# EasyEDA Pro project Photo_cam.epro

# Board PCB1
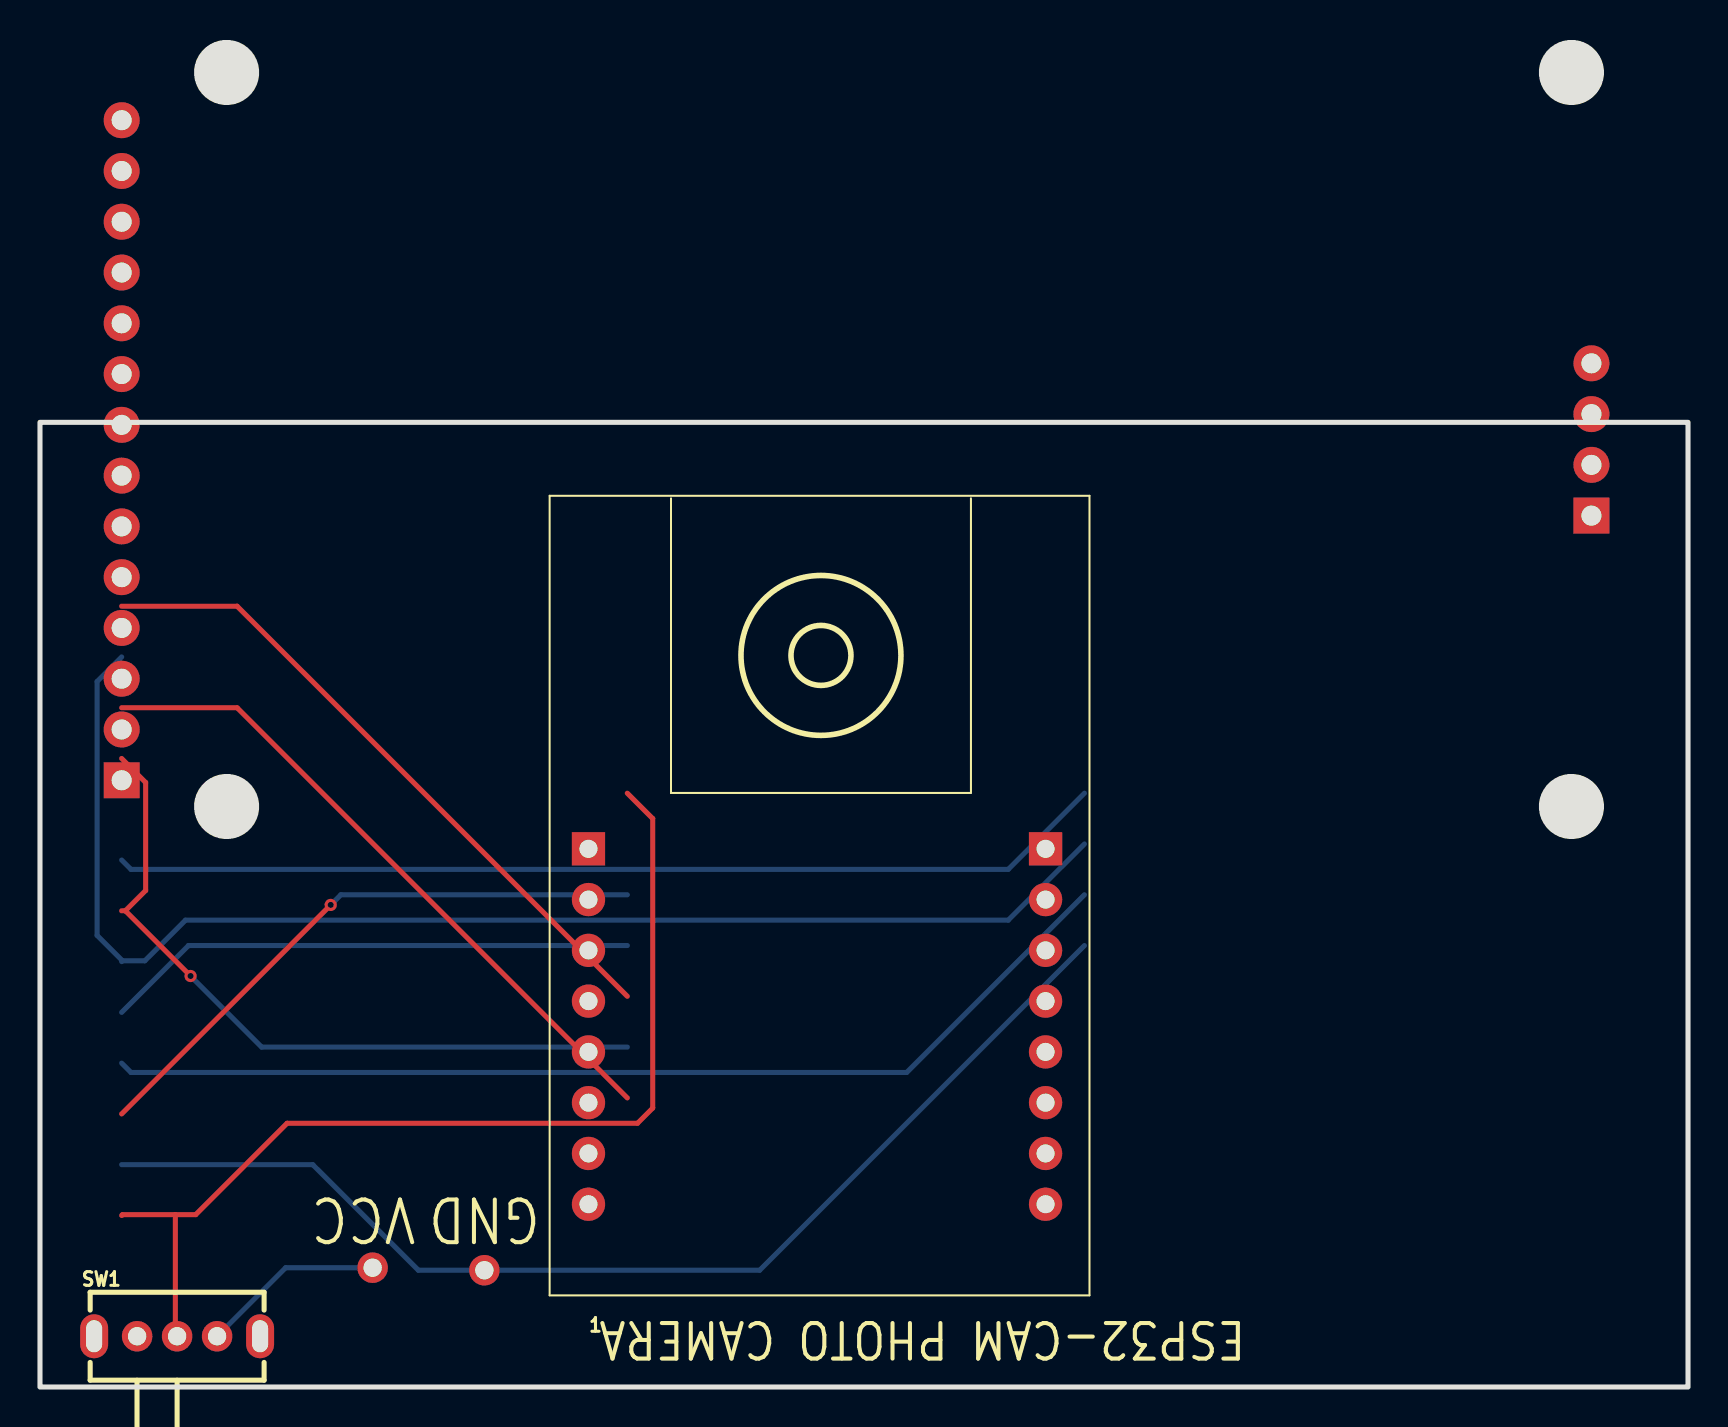
[diagram p0: board, top side]
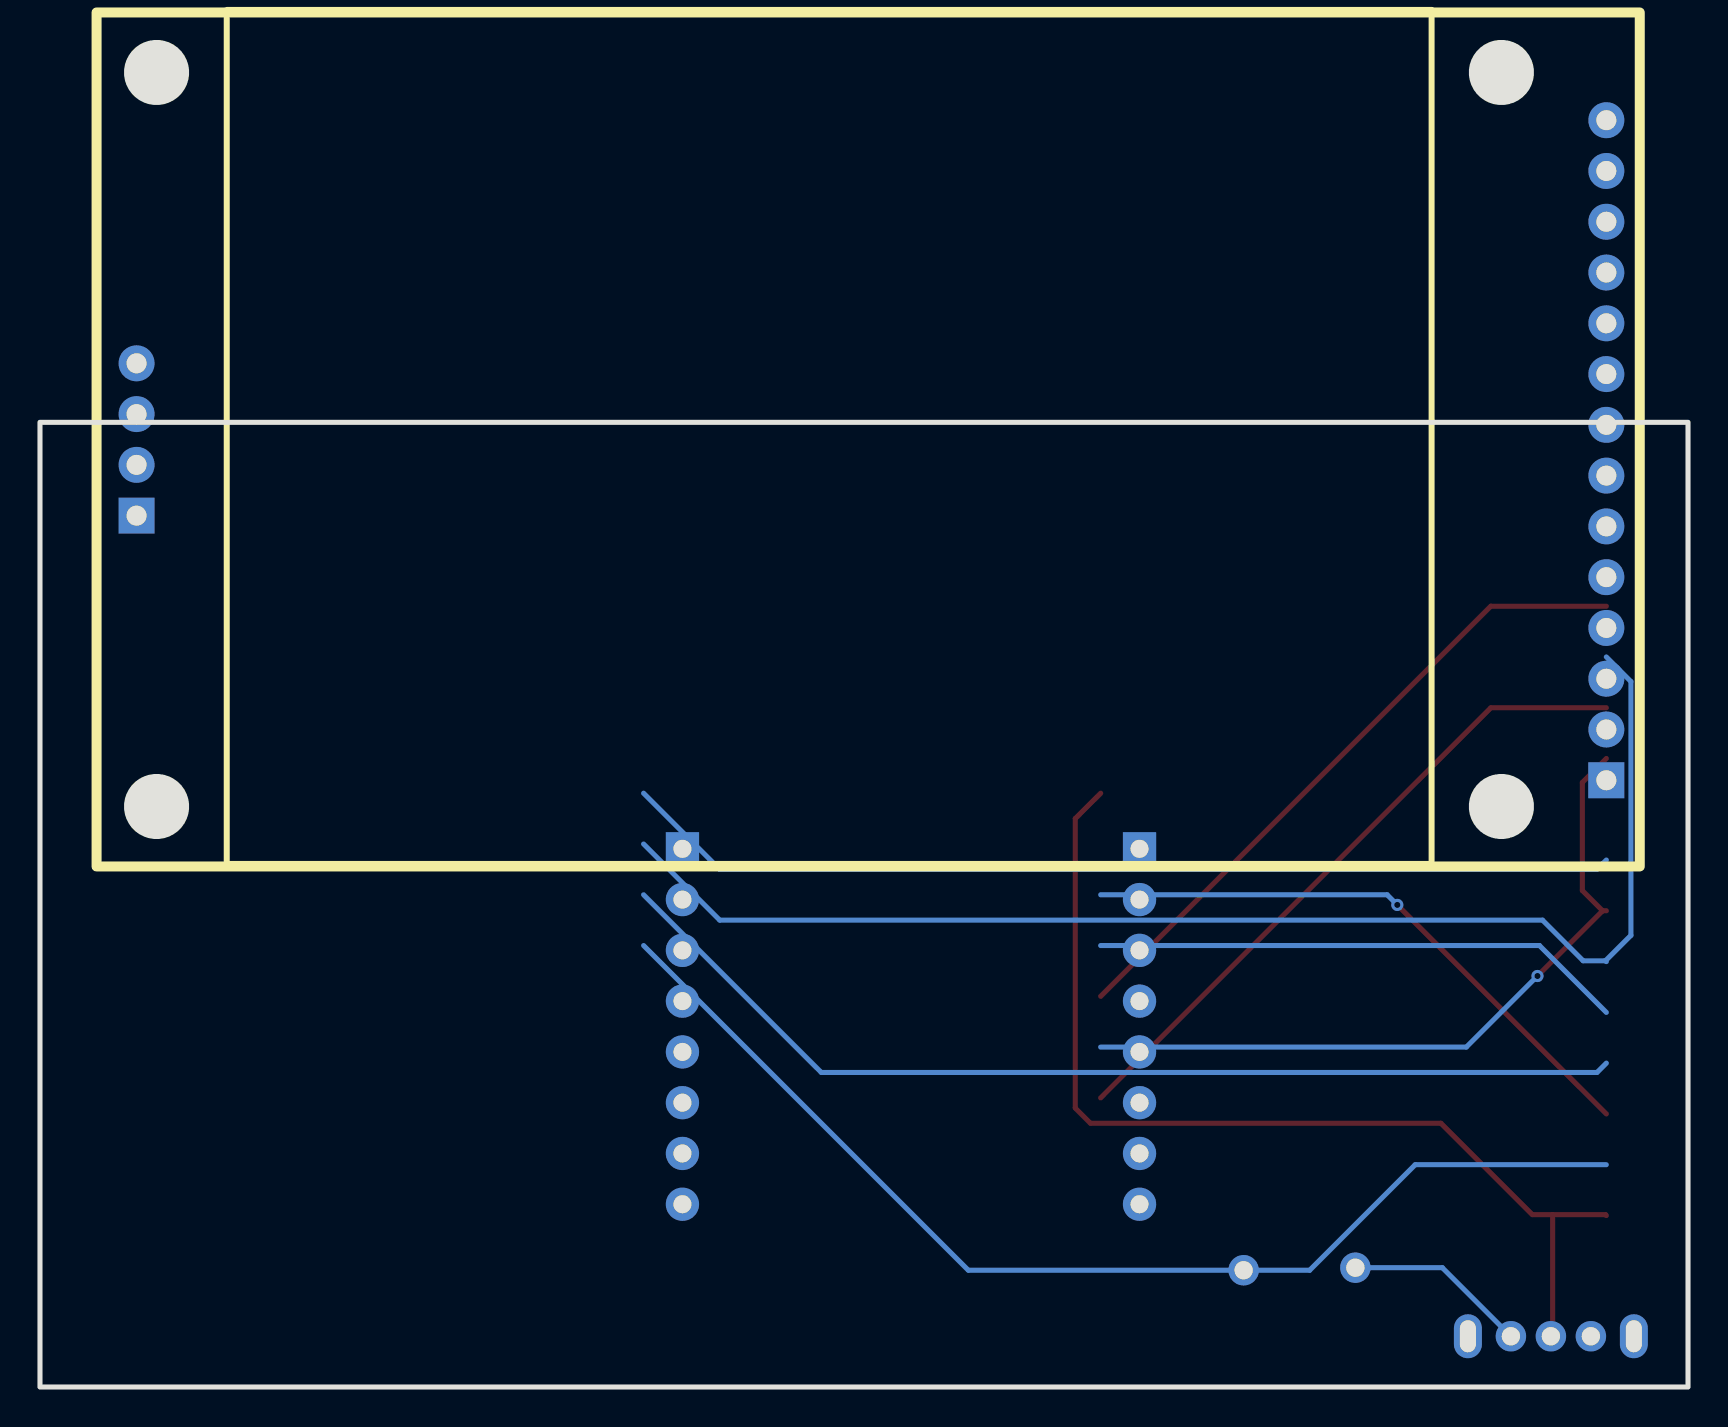
[diagram p1: board, bottom side, seen from below]

Outline 82.42 x 67.39 mm; copper layers: Top Layer, Bottom Layer. Coordinates in mm from the lower left corner of the outline.
Outline path: rectangle 82.42,0 0,48.26
Stack: Top Layer 0.035mm / Dielectric1 1.51mm FR4 er 4.5 / Bottom Layer 0.035mm

## Design rules (mm)
template: JLCPCB Capability(Two Layers Board)
spacing copperThickness1oz (default): track to track 0.102, other pairs 0.152 to 0.3
spacing copperThickness2oz: track to track 0.203, other pairs 0.152 to 0.3
track width copperThickness1oz (default): min 0.127, default 0.254, max 2.54
track width copperThickness2oz: min 0.203, default 0.254, max 2.54
differential pair differentialPair (default): width min 0.127, default 0.254, max 2.54; gap min 0.152, default 0.152
via viaSize (default): diameter min 0.5, default 0.61, max 10; hole min 0.3, default 0.305, max 6.3

## Placement (name value [footprint] x y rotation side)
1  94ec7cddaf394149a8ac4084ca1b2122  [ESP32-CAM]  27.43 7.37 0 top
DISPLAY_ILI9341_TOUCH_2.4IN_VERSION2V  -  [display_ili9341_touch_2.4in_version2]  2.41 46.99 0 bottom
NOREF  -  [Pad_e509]  22.22 5.84 0 top
NOREF#2  -  [Pad_e508]  16.64 5.97 0 top
SW1  SK12D07VG4  [SW-TH_SK12D07VG4]  6.86 2.54 0 top

## Footprints (pads in the part's own frame, mm; a bottom-side part is the same pattern mirrored in y, then rotated)
display_ili9341_touch_2.4in_version2
  rect 1.8x1.8 hole 1: 1(1.672,16.637) 15(75.18,3.399)
  round 1.8 hole 1: 2(1.672,14.097) 3(1.672,11.557) 4(1.672,9.017) 5(1.672,6.477) 6(1.672,3.937) 7(1.672,1.397) 8(1.672,-1.143) 9(1.672,-3.683) 10(1.672,-6.223) 11(1.672,-8.763) 12(1.672,-11.303) 13(1.672,-13.843) 14(1.672,-16.383) 16(75.18,0.859) 17(75.18,-1.681) 18(75.18,-4.221)
ESP32-CAM
  round 1.665 hole 0.9: 1(0,1.778) 2(0,4.318) 3(0,6.858) 4(0,9.398) 5(0,11.938) 6(0,14.478) 7(0,17.018) 10(22.86,17.018) 11(22.86,14.478) 12(22.86,11.938) 13(22.86,9.398) 14(22.86,6.858) 15(22.86,4.318) 16(22.86,1.778)
  rect 1.665x1.665 hole 0.9: 8(0,19.558) 9(22.86,19.558)
Pad_e508
  round 1.524 hole 0.914x0.076: 1(0,0)
Pad_e509
  round 1.524 hole 0.914x0.076: 2(0,0)
SW-TH_SK12D07VG4
  round 1.524 hole 0.914: 1(-2,0) 2(0,0) 3(2,0)
  oval 1.4x2.2 hole 0.8x1.6: 4(4.15,0) 5(-4.15,0)

## Nets
3V3: 1.9 DISPLAY_ILI9341_TOUCH_2.4IN_VERSION2V.8
5V: 1.8 DISPLAY_ILI9341_TOUCH_2.4IN_VERSION2V.1 SW1.2
GND: 1.12 DISPLAY_ILI9341_TOUCH_2.4IN_VERSION2V.2 NOREF.2
CLK: 1.3 DISPLAY_ILI9341_TOUCH_2.4IN_VERSION2V.7 DISPLAY_ILI9341_TOUCH_2.4IN_VERSION2V.10
MISO/DO: 1.4 DISPLAY_ILI9341_TOUCH_2.4IN_VERSION2V.13
MOSI/DIN: 1.10 DISPLAY_ILI9341_TOUCH_2.4IN_VERSION2V.6 DISPLAY_ILI9341_TOUCH_2.4IN_VERSION2V.12
RESET: 1.11 DISPLAY_ILI9341_TOUCH_2.4IN_VERSION2V.4
T_CS: 1.2 DISPLAY_ILI9341_TOUCH_2.4IN_VERSION2V.11
TFT_CS: 1.6 DISPLAY_ILI9341_TOUCH_2.4IN_VERSION2V.3
TFT_DC: 1.5 DISPLAY_ILI9341_TOUCH_2.4IN_VERSION2V.5
$1N1391: NOREF#2.1 SW1.3

Pads without a net: 1 1 7 13 14 15 16; DISPLAY_ILI9341_TOUCH_2.4IN_VERSION2V 9 14 15 16 17 18; SW1 1 4 5

## Via types
v1: diameter 0.61, hole 0.305, Top Layer to Bottom Layer, 2 vias

## Routing (per net, layer and track width the routed paths; a pad name or vN(x,y) marks a point on that pad's centre or on a via; arc(x,y) is an arc through that point)
3V3: length 49.9
  Bottom Layer w0.254: 52.23,29.7 48.42,25.89 4.55,25.89 4.08,26.36
5V: length 51.2
  Top Layer w0.254: SW1.2 6.77,2.63 6.77,8.62 ; 6.77,8.62 7.78,8.62 12.36,13.19 29.88,13.19 30.65,13.96 30.65,28.43 29.38,29.7 ; 6.77,8.62 4.13,8.62 4.08,8.58
GND: length 57.1
  Bottom Layer w0.254: 52.23,22.08 35.99,5.84 NOREF.2 18.92,5.84 13.64,11.12 4.08,11.12
CLK: length 36.7
  Top Layer w0.254: 4.27,23.82 5.29,24.84 5.29,30.24 4.08,31.44 ; 4.27,23.82 4.08,23.82 ; 4.27,23.82 v1(7.53,20.56)
  Bottom Layer w0.254: 29.38,17 11.09,17 v1(7.53,20.56)
MISO/DO: length 33.4
  Top Layer w0.254: 29.38,19.54 9.86,39.06 4.08,39.06
MOSI/DIN: length 66.8
  Bottom Layer w0.254: 4.13,21.32 4.08,21.28 ; 4.13,21.32 2.86,22.59 2.86,35.29 4.08,36.52 ; 4.13,21.32 5.24,21.32 7.28,23.35 48.42,23.35 52.23,27.16
RESET: length 52
  Bottom Layer w0.254: 4.08,16.2 4.55,15.73 43.34,15.73 52.23,24.62
T_CS: length 33.4
  Top Layer w0.254: 4.08,33.98 9.86,33.98 29.38,14.46
TFT_CS: length 29.8
  Top Layer w0.254: v1(14.54,24.12) 4.08,13.66
  Bottom Layer w0.254: v1(14.54,24.12) 15.05,24.62 29.38,24.62
TFT_DC: length 26.7
  Bottom Layer w0.254: 4.08,18.74 7.43,22.08 29.38,22.08
$1N1391: length 9.2
  Bottom Layer w0.254: SW1.3 12.29,5.97 NOREF#2.1

## Text on the board
Top Silkscreen Layer: ESP32-CAM PHOTO CAMERA | VCC | GND
